# EAGLE design b (EAGLE 9.6.2)
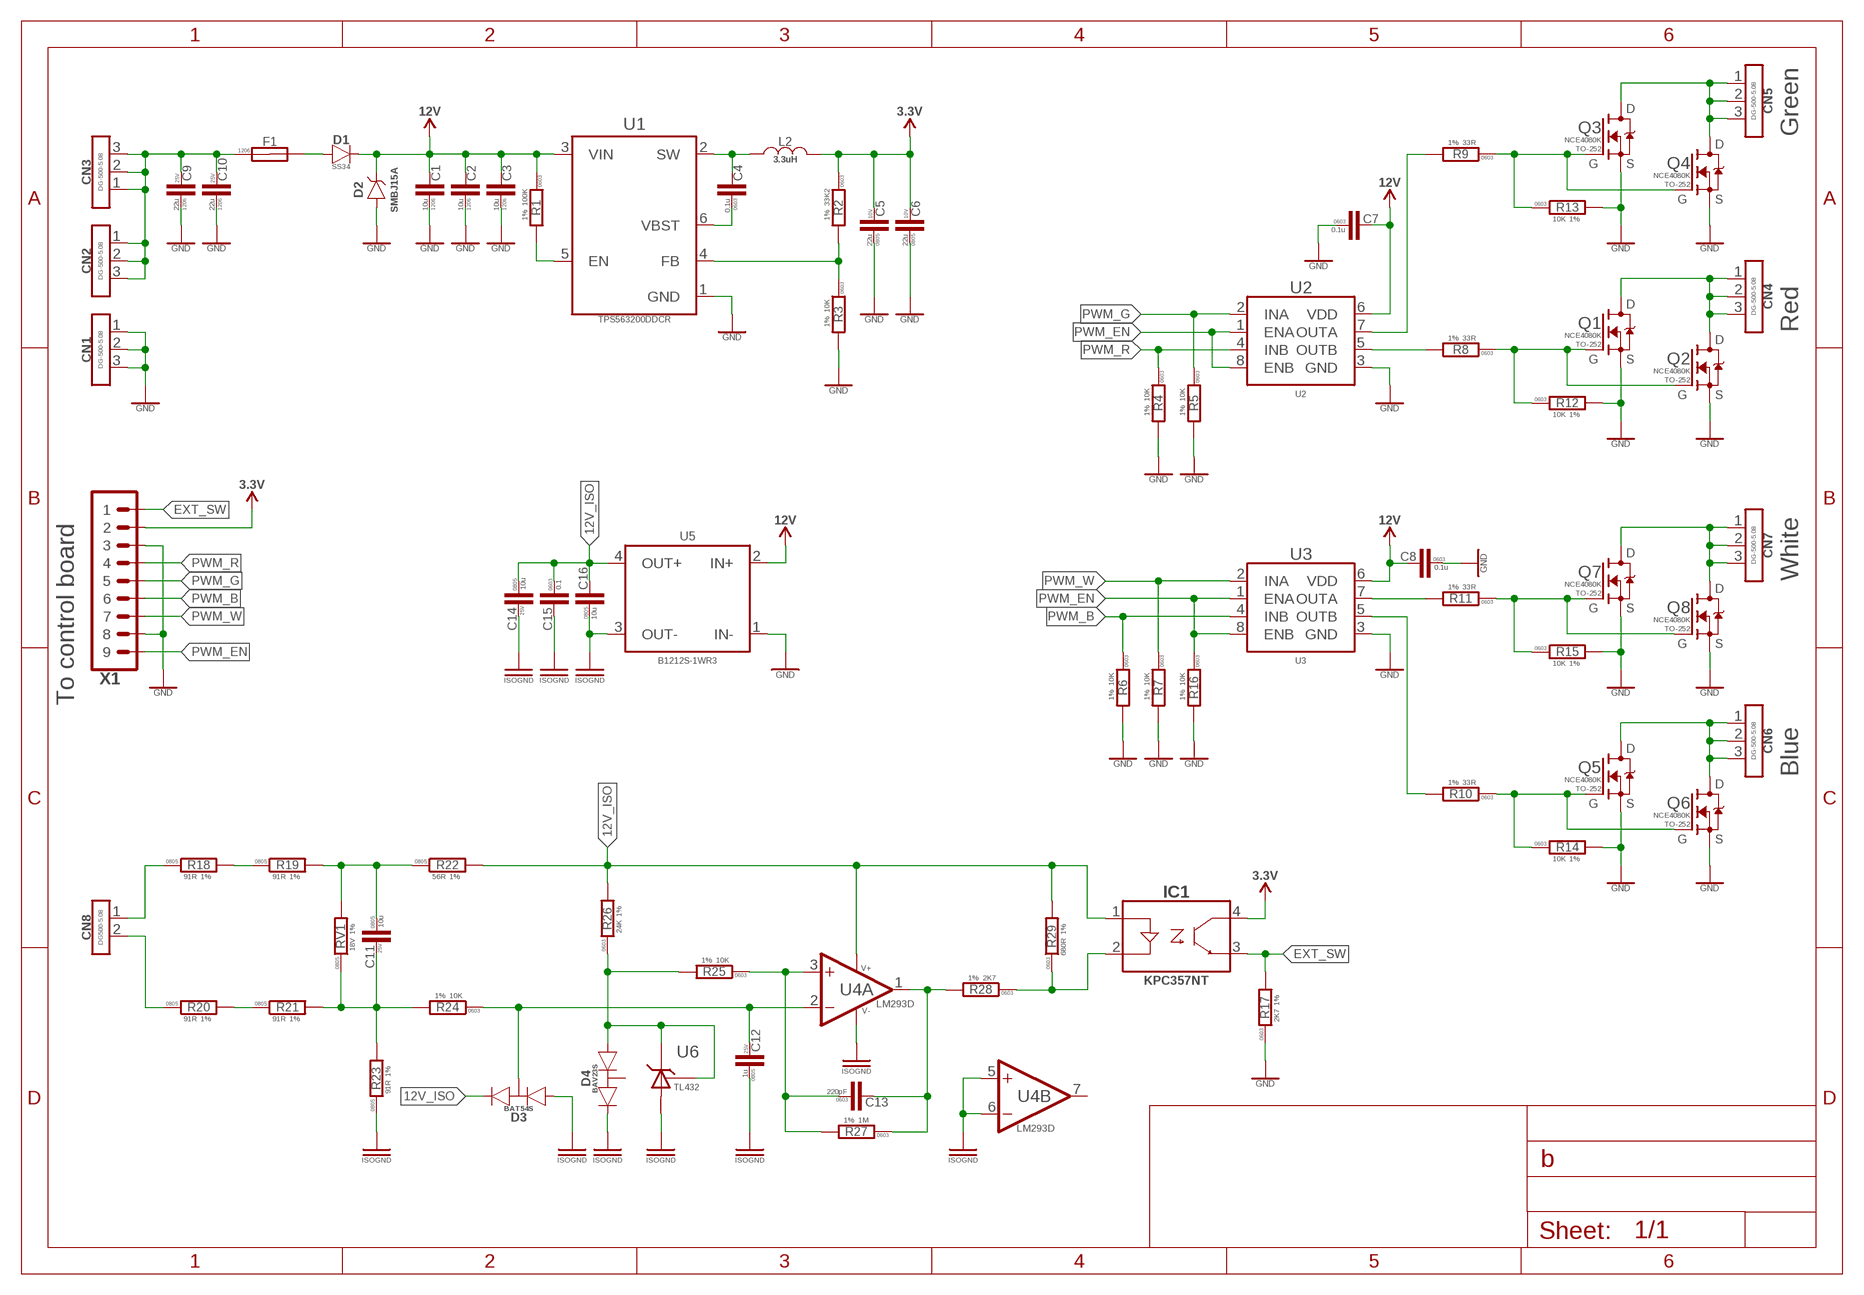
[diagram p0: schematic, sheet 1]

## Parts
C1  10u  C-1206  [C1206]
C2  10u  C-1206  [C1206]
C3  10u  C-1206  [C1206]
C4  0.1u  C-0603  [C0603]
C5  22u  C-0805  [C0805]
C6  22u  C-0805  [C0805]
C7  0.1u  C-0603  [C0603]
C8  0.1u  C-0603  [C0603]
C9  22u  C-1206  [C1206]
C10  22u  C-1206  [C1206]
C11  10u  C-0805  [C0805]
C12  1u  C-0805  [C0805]
C13  220pF  C-0603  [C0603]
C14  10u  C-0805  [C0805]
C15  0.1  C-0603  [C0603]
C16  10u  C-0805  [C0805]
CN1  CON-3P-DG500-5.08  [DG500-5.08-03P]
CN2  CON-3P-DG500-5.08  [DG500-5.08-03P]
CN3  CON-3P-DG500-5.08  [DG500-5.08-03P]
CN4  CON-3P-DG500-5.08  [DG500-5.08-03P]
CN5  CON-3P-DG500-5.08  [DG500-5.08-03P]
CN6  CON-3P-DG500-5.08  [DG500-5.08-03P]
CN7  CON-3P-DG500-5.08  [DG500-5.08-03P]
CN8  DG508V-2P  CON-2P-DG500-5.08  [DG500-5.08-02P]
D1  SS24  SS34  [DO-214AC(SMA)]
D2  SMBJ15A-SMB  [DO-214AA(SMB)]
D3  BAT54S  BAT54S-SOT23  [SOT23]
D4  BAV23S-SOT23  [SOT23]
F1  eFUSE-1206-500mA  FUSE-1206  [F1206]
IC1  KPC357NT-SOP-4  [-SOP-4]
L2  3.3uH  3.3µH-SWPA6020  [SWPA6020]
Q1  100N04  NCE4080K  [D-PAK]
Q2  100N04  NCE4080K  [D-PAK]
Q3  100N04  NCE4080K  [D-PAK]
Q4  100N04  NCE4080K  [D-PAK]
Q5  100N04  NCE4080K  [D-PAK]
Q6  100N04  NCE4080K  [D-PAK]
Q7  100N04  NCE4080K  [D-PAK]
Q8  100N04  NCE4080K  [D-PAK]
R1  100K  R-1%-0603  [R0603]
R2  33K2  R-1%-0603  [R0603]
R3  10K  R-1%-0603  [R0603]
R4  10K  R-1%-0603  [R0603]
R5  10K  R-1%-0603  [R0603]
R6  10K  R-1%-0603  [R0603]
R7  10K  R-1%-0603  [R0603]
R8  33R  R-1%-0603  [R0603]
R9  33R  R-1%-0603  [R0603]
R10  33R  R-1%-0603  [R0603]
R11  33R  R-1%-0603  [R0603]
R12  10K  R-1%-0603  [R0603]
R13  10K  R-1%-0603  [R0603]
R14  10K  R-1%-0603  [R0603]
R15  10K  R-1%-0603  [R0603]
R16  10K  R-1%-0603  [R0603]
R17  2K7  R-1%-0603  [R0603]
R18  91R  R-1%-0805  [R0805]
R19  91R  R-1%-0805  [R0805]
R20  91R  R-1%-0805  [R0805]
R21  91R  R-1%-0805  [R0805]
R22  56R  R-1%-0805  [R0805]
R23  91R  R-1%-0805  [R0805]
R24  10K  R-1%-0603  [R0603]
R25  10K  R-1%-0603  [R0603]
R26  24K  R-1%-0603  [R0603]
R27  1M  R-1%-0603  [R0603]
R28  2K7  R-1%-0603  [R0603]
R29  680R  R-1%-0603  [R0603]
RV1  18V  R-1%-0805  [R0805]
U1  TPS563200  [SOT23-6]
U2  PN7762S  [SOIC8]
U3  PN7762S  [SOIC8]
U4  LM293D  LM293D-SO8  [SOIC8]
U5  B1212S-1WR3  [SIP-4]
U6  TL432  [SOT23B-3]
X1  PINHEAD_1X09-2.54-TH-MALE  [1X09-PTH-2.54]

## Nets
12V_ISO: C14.1 C15.1 C16.2 D3.2(C) IC1.1(A) R22.2 R26.2 R29.2 U4.8(P:V+) U5.4(OUT+)
B_OUT: CN6.1 CN6.2 CN6.3 Q5.D Q6.D
EXT_SW: IC1.3(EMITTER) R17.2 X1.1
G_OUT: CN5.1 CN5.2 CN5.3 Q3.D Q4.D
GND: C1.P$1 C2.P$1 C3.P$1 C5.1 C6.1 C7.1 C8.1 C9.P$1 C10.P$1 CN1.1 CN1.2 CN1.3 D2.A Q1.S Q2.S Q3.S Q4.S Q5.S Q6.S Q7.S Q8.S R3.2 R4.2 R5.2 R6.2 R7.2 R12.2 R13.2 R14.2 R15.2 R16.2 R17.1 U1.1(GND) U2.3(GND) U3.3(GND) U5.1(IN-) X1.3 X1.8
ISOGND: C12.1 C14.2 C15.2 C16.1 D3.1(A) D4.2(C) R23.1 U4.4(P:V-) U4.5(B:IN+) U4.6(B:IN-) U5.3(OUT-) U6.3(A)
N$1: Q1.G Q2.G R8.1 R12.1
N$2: R1.2 U1.5(EN)
N$3: Q3.G Q4.G R9.1 R13.1
N$4: D1.A F1.P$2
N$8: R11.2 U3.7(OUTA)
N$9: R10.2 U3.5(OUTB)
N$10: R8.2 U2.5(OUTB)
N$11: Q5.G Q6.G R10.1 R14.1
N$13: Q7.G Q8.G R11.1 R15.1
N$15: C4.1 U1.6(VBST)
N$18: R9.2 U2.7(OUTA)
N$19: C4.2 L2.1 U1.2(SW)
N$23: IC1.2(C) R28.1 R29.1
N$27: R2.2 R3.1 U1.4(FB)
N$31: C13.2 R27.1 R28.2 U4.1(A:OUT)
N$40: C12.2 D3.3(COMMON) R24.1 U4.2(A:IN-)
N$57 [24V]: C11.1 R19.2 R22.1 RV1.2
N$66 [24V]: R18.2 R19.1
N$71 [24V]: R20.2 R21.1
N$73: C13.1 R25.1 R27.2 U4.3(A:IN+)
N$74: D4.1(A) R25.2 R26.1 U6.1(R) U6.2(C)
N$76: C11.2 R21.2 R23.2 R24.2 RV1.1
PWM_B: R6.1 U3.4(INB) X1.6
PWM_EN: R16.1 U2.1(ENA) U2.8(ENB) U3.1(ENA) U3.8(ENB) X1.9
PWM_G: R5.1 U2.2(INA) X1.5
PWM_R: R4.1 U2.4(INB) X1.4
PWM_W: R7.1 U3.2(INA) X1.7
R_OUT: CN4.1 CN4.2 CN4.3 Q1.D Q2.D
SW_IN+ [24V]: CN8.1 R18.1
SW_IN- [24V]: CN8.2 R20.1
V+: C9.P$2 C10.P$2 CN2.1 CN2.2 CN2.3 CN3.1 CN3.2 CN3.3 F1.P$1
VDD_3V3: C5.2 C6.2 IC1.4(COLLECTOR) L2.2 R2.1 X1.2 ; supply symbol labelled 3.3V
VDD_12V: C1.P$2 C2.P$2 C3.P$2 C7.2 C8.2 D1.C D2.C R1.1 U1.3(VIN) U2.6(VDD) U3.6(VDD) U5.2(IN+) ; supply symbol labelled 12V
Y_OUT: CN7.1 CN7.2 CN7.3 Q7.D Q8.D
Unconnected: D4.3(COMMON) U4.7(B:OUT)

## Notes on the sheet
- Green
- Red
- White
- To control board
- Blue

## Library data of the parts
C1-C3 = rc:C; PACKAGE: 1206
C4 C7 C8 C13 C15 = rc:C; PACKAGE: 0603
C5 C6 = rc:C; PACKAGE: 0805; VOLTAGE: 10V
C9 C10 = rc:C; PACKAGE: 1206; VOLTAGE: 25V
C11 C12 C14 = rc:C; PACKAGE: 0805; VOLTAGE: 25V
C16 = rc:C; PACKAGE: 0805
CN1-CN7 = degson:CON-3P; MANF: Degson Electronics; MANF#: DG-500-5.08-03P-14; TYPE: DG-500-5.08
CN8 = degson:CON-2P; MANF: Degson Electronics; MANF#: DG-500-5.08-02P-14; TYPE: DG500-5.08
D1 = Diodes:SS34: 40V 3A 550mV @ 3A SMA(DO-214AC) Schottky Barrier Diodes; LCSC#: C8678; MANF: MDD（Microdiode Electronics）; MANF#: SS34
D2 = TVS_diodes:SMBJ15A: 15V Unidirectional SMB(DO-214AA) TVS ROHS; MANF: Littelfuse; MANF#: SMBJ15A
D3 = Diodes:BAT54S: Planar Schottky barrier diodes; MANF: NEXPERIA; MANF#: BAT54S
D4 = Diodes:BAV23S: Small Signal Diode; MANF: NEXPERIA; MANF#: BAV23S
F1 = rc:FUSE; CURRENT: 500 mA; PACKAGE: 1206
IC1 = misc:KPC357NT: 4PIN MINI-FLAT PHOTOTRANSISTOR PHOTOCOUPLER; MANF: COSMO; MANF#: KPC357NT
L2 = power_inductors:3.3µH; MANF: Sunlord; MANF#: SWPA6020S3R3NT
Q1-Q8 = mosfet:NCE4080K: N-Channel 75V 42A power MOSFET, Rdson = 0.026 Ohm; MANF: NCE; MANF#: NCE4080K; PACKAGE: TO-252
R1-R17 R24-R29 = rc:R; PACKAGE: 0603; TOLERANCE: 1%
R18-R23 RV1 = rc:R; PACKAGE: 0805; TOLERANCE: 1%
U1 = dc-dc:TPS563200: TPS56x200 4.5-V To 17-V Input, 2-A, 3-A Synchronous Step-Down Voltage Regulator In6 Pin SOT-23 datasheet <https://static.chipdip.ru/lib/786/DOC059786447.pdf>; MANF: Texas Instruments; MANF#: TPS563200DDCR
U2 U3 = misc:PN7762S: Dual channel 5A mosfet driver; MANF: Chipown; MANF#: PN7762S
U4 = misc:LM293D: Low-power, dual-voltage comparators; MANF: STMicroelectronics; MANF#: LM293D
U5 = dc-dc:B1212S-1WR3: 1W, Fixed input voltage, isolated & unregulated single output dc-dc converter; MANF: Mornsun Power; MANF#: B1212S-1WR3
U6 = misc:TL432: Adjustable precision shunt regulator (reverse pinout); MANF: Texas Instruments; MANF#: TL432
X1 = pinhead:PINHEAD_1X09

## Net classes
0 default: width 0.254 mm, clearance 0.254 mm
1 24V: clearance 0.305 mm
2 12v: width 0.254 mm, drill 0.508 mm, clearance 0.254 mm
3 rs485: width 0.254 mm, drill 0.508 mm, clearance 0.254 mm
12 Vbat: width 0.229 mm, clearance 0.305 mm

## Board
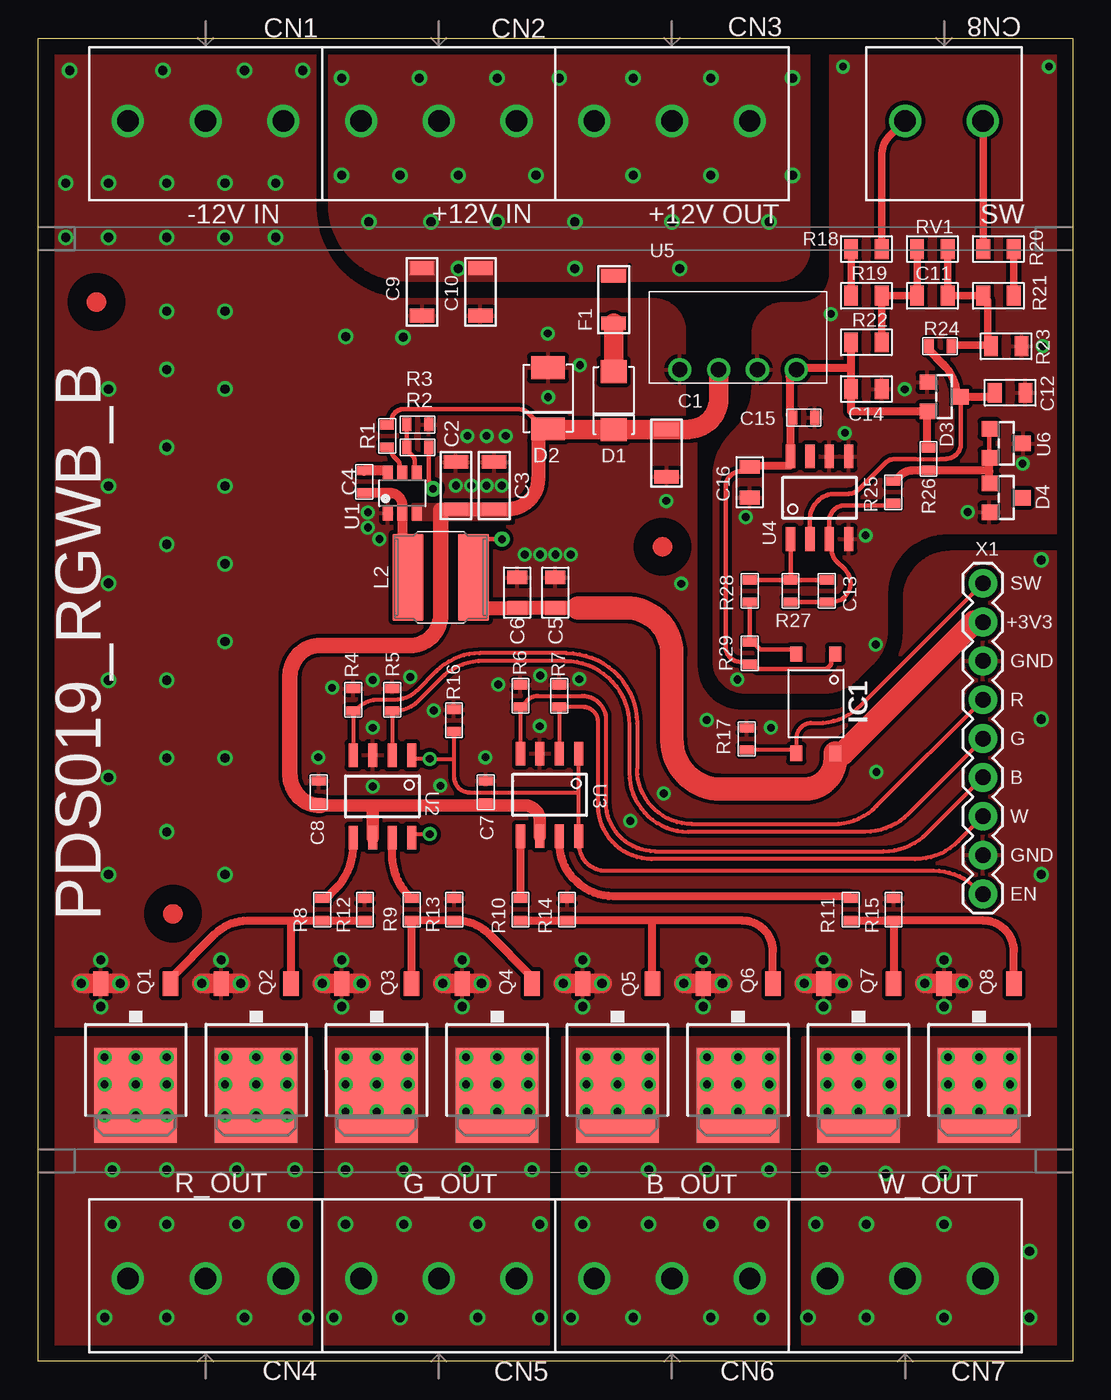
[diagram p1: board, top side]
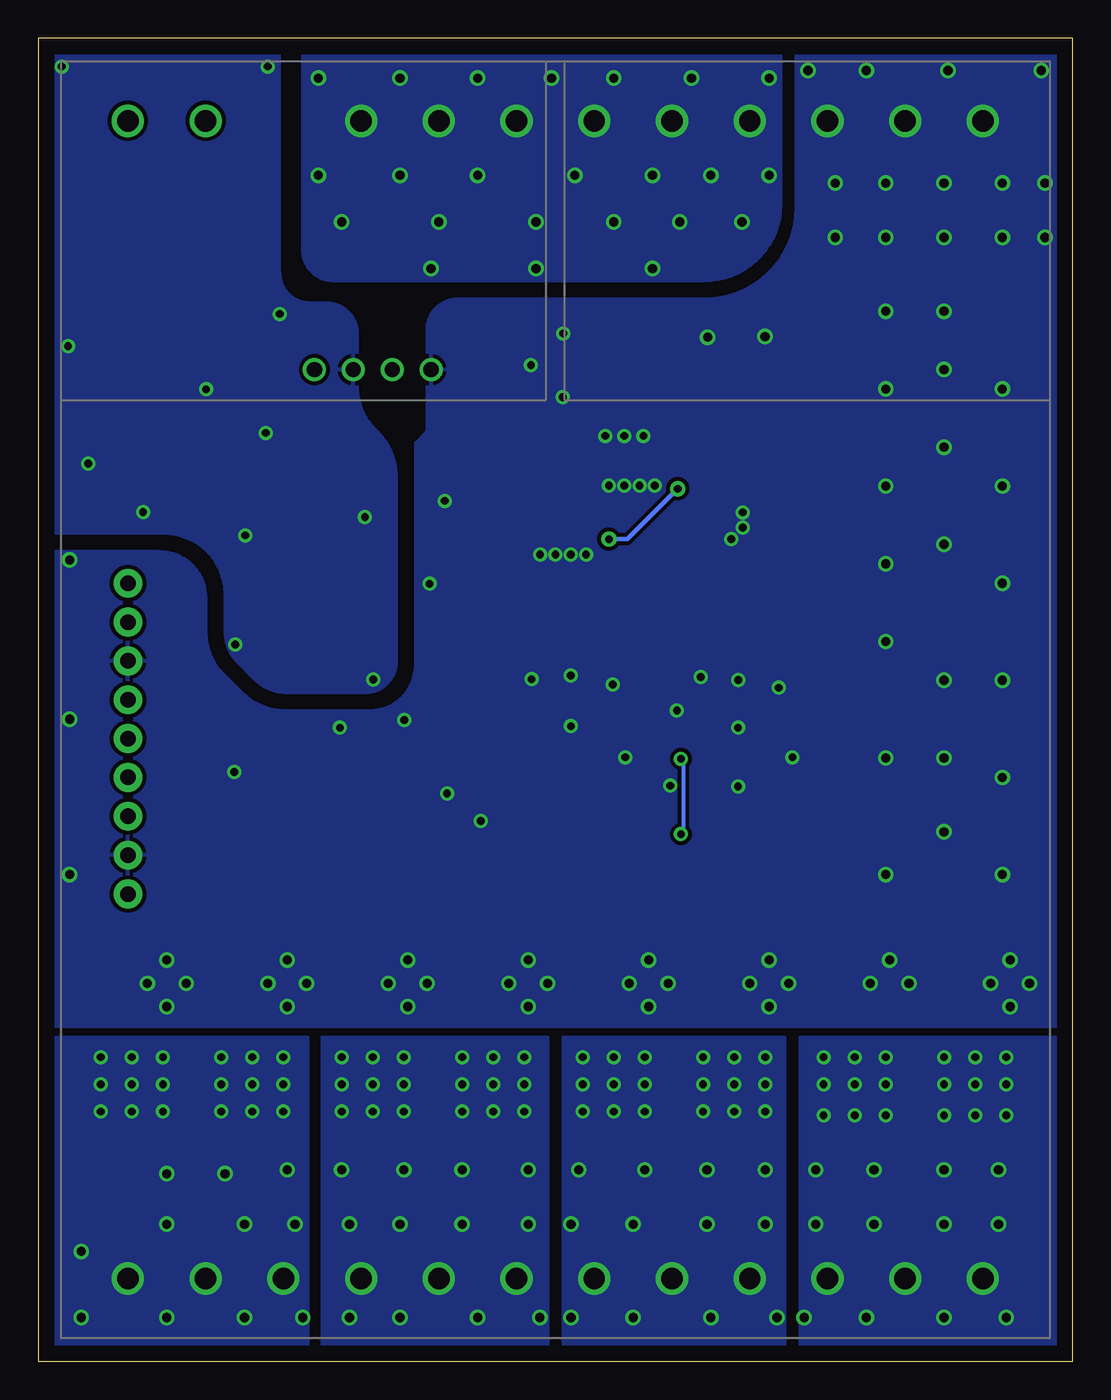
[diagram p2: board, bottom side, seen from below]

Size 67.6 x 86.5 mm. Coordinates in mm from the lower left corner, seen from the top.
Outline: 0,86.5 67.6,86.5 67.6,0 0,0 0,86.5
Copper layers (1*16): Top 0.035mm / dielectric 1.5mm / Bottom 0.035mm
Design rules "pds019_rgbw *": minimum track width 8mil, minimum drill 0.5mm, track to track 8mil, track to pad 8mil, pad to pad 8mil, via to via 8mil, smd to smd 0mil, copper to edge 40mil, drill to drill 8mil, minimum pad ring 10mil, minimum via ring 8mil, stop-mask expansion 4mil, vias tented up to drill 0.7mm, thermal gap 10mil
tRestrict: 2 lines

### Footprints (pad centres in the part's own frame; a part is rotated, then mirrored left to right if it is on the bottom)
C1206 = smd 0.9 x 1.6: P$1 -1.55,0; P$2 1.55,0
C0603 = smd 0.6 x 0.9: 1 -0.725,0; 2 0.725,0
C0805 = smd 0.9 x 1.3: 1 -1,0; 2 1,0
DG500-5.08-03P = drill 1.4: 1 -5.08,0; 2 0,0; 3 5.08,0
DG500-5.08-02P = drill 1.4: 1 -2.54,0; 2 2.54,0
DO-214AC(SMA) = smd 1.5 x 1.7: A -1.9,0; C 1.9,0
DO-214AA(SMB) = smd 1.5 x 2.2: A -2,0; C 2,0
SOT23 = smd 1 x 1: 1 1.1,-0.95; 2 1.1,0.95; 3 -1.1,0
F1206 = smd 0.9 x 1.6: P$1 -1.55,0; P$2 1.55,0
-SOP-4 = smd 1 x 0.8: 1 -3.25,1.27; 2 -3.25,-1.27; 3 3.25,-1.27; 4 3.25,1.27
SWPA6020 = smd 2.032 x 5.69: 1 -2.134,0; 2 2.134,0
D-PAK = smd 5.4 x 6.2: D 0,2.5 | smd 1 x 1.6: G -2.28,-4.8; S 2.28,-4.8
R0603 = smd 0.6 x 0.9: 1 -0.725,0; 2 0.725,0
R0805 = smd 0.9 x 1.3: 1 -1,0; 2 1,0
SOT23-6 = smd 1 x 0.65: 1 1.3,-0.95; 2 1.3,0; 3 1.3,0.95; 4 -1.3,0.95; 5 -1.3,0; 6 -1.3,-0.95
SOIC8 = smd 0.6 x 1.55: 1 -1.905,-2.7; 2 -0.635,-2.7; 3 0.635,-2.7; 4 1.905,-2.7; 5 1.905,2.7; 6 0.635,2.7; 7 -0.635,2.7; 8 -1.905,2.7
SIP-4 = drill 1 pad 1.5: 1 -3.81,-2.1; 2 -1.27,-2.1; 3 1.27,-2.1; 4 3.81,-2.1
SOT23B-3 = smd 1 x 1: 1 -0.95,-1.1; 2 0.95,-1.1; 3 0,1.1
1X09-PTH-2.54 = drill 1.016 pad 1.88: 1 -10.16,0; 2 -7.62,0; 3 -5.08,0; 4 -2.54,0; 5 0,0; 6 2.54,0; 7 5.08,0; 8 7.62,0; 9 10.16,0

### Placement (x,y rotation side)
C1  41.06,59.38 90 top
C2  27.3,57.25 270 top
C3  29.8,57.25 270 top
C4  21.3,57.5 270 top
C5  33.8,50.25 270 top
C6  31.3,50.25 270 top
C7  29.25,37.2 270 top
C8  18.33,37.2 270 top
C9  25.08,69.92 90 top
C10  28.89,69.92 90 top
C11  58.44,69.67 0 top
C12  63.52,63.32 180 top
C13  51.53,50.36 90 top
C14  54.12,63.57 0 top
C15  50.03,61.69 0 top
C16  46.5,57.47 90 top
CN1  10.94,81.1 0 top
CN2  26.18,81.1 0 top
CN3  41.42,81.1 0 top
CN4  10.94,5.4 180 top
CN5  26.18,5.4 180 top
CN6  41.42,5.4 180 top
CN7  56.66,5.4 180 top
CN8  59.2,81.1 0 top
D1  37.61,62.81 270 top
D2  33.32,62.96 270 top
D3  59.2,63.06 180 top
D4  63.26,56.46 180 top
F1  37.61,69.41 270 top
IC1  50.82,43 270 top
L2  26.3,51.25 0 top
PCB1  [D4MG_PCB]  33.8,43.25 0 top
Q1  6.37,19.88 180 top
Q2  14.24,19.88 180 top
Q3  22.12,19.88 180 top
Q4  29.99,19.88 180 top
Q5  37.86,19.88 180 top
Q6  45.74,19.88 180 top
Q7  61.49,19.88 180 top
Q8  53.61,19.88 180 top
R1  22.8,60.5 270 top
R2  24.8,59.75 180 top
R3  24.8,61.25 0 top
R4  20.59,43.25 90 top
R5  23.13,43.25 90 top
R6  31.51,43.5 90 top
R7  34.05,43.5 90 top
R8  18.56,29.53 90 top
R9  24.4,29.53 90 top
R10  31.51,29.53 90 top
R11  53.1,29.53 90 top
R12  21.35,29.53 90 top
R13  27.2,29.53 90 top
R14  34.56,29.53 90 top
R15  55.9,29.53 90 top
R16  27.17,41.9 90 top
R17  46.3,40.68 270 top
R18  54.12,72.71 180 top
R19  54.12,69.67 0 top
R20  62.76,72.71 0 top
R21  62.76,69.67 180 top
R22  54.12,66.62 180 top
R23  63.26,66.36 180 top
R24  58.95,66.36 0 top
R25  55.87,56.81 90 top
R26  58.18,59 90 top
R27  49.17,50.36 270 top
R28  46.5,50.36 90 top
R29  46.5,46.3 270 top
REP1  [REF_POINT_D1.27_D3.81]  8.8,29.25 0 top
REP2  [REF_POINT_D1.27_D3.81]  3.8,69.25 0 top
REP3  [REF_POINT_D1.27_D3.81]  40.8,53.25 0 top
RV1  58.44,72.71 180 top
U1  23.8,56.75 270 top
U2  22.5,36.93 180 top
U3  33.42,37.03 180 top
U4  51.07,56.46 0 top
U5  45.74,66.94 0 top
U6  63.26,60.01 270 top
X1  61.74,40.71 270 top

### Tracks (layer width: path | path; a pad name or v marks a point on that pad's centre or on a via)
12V_ISO
  Top 0.305: C16.2 46.2,58.17 45.92,58.17 arc90 44.92,57.17 44.92,46.72 arc90 45.92,45.72 46.35,45.72 R29.2 46.68,45.57 47,45.25 51.34,45.25 arc90 51.84,45.75 51.84,46.25 IC1.1
  Top 0.508: 53.12,64.95 C14.1 53.1,63.55 53.1,62.12 53.11,62.11 D3.2 58.1,59.81 R26.2 | 53.12,64.95 R22.2 | 53.12,64.95 49.66,64.95 U5.4 49.11,64.4 49.11,61.89 C15.1 49.17,61.55 U4.8 49.17,58.57 46.6,58.57 C16.2
B_OUT  (via drill 0.51, 0.6)
  other vias: 35.83,19.88 39.9,18.1 37.86,19.88 39.9,19.88 43.71,19.88 35.83,18.1 37.86,18.1 43.71,18.1 35.83,16.33 37.86,16.33 39.9,16.33 43.71,16.33 45.74,19.88 47.77,19.88 45.74,18.1 47.77,18.1 45.74,16.33 47.77,16.33 35.58,8.96 39.9,8.96 43.96,8.96 47.26,8.96 34.82,2.86 38.88,2.86 43.96,2.86 47.26,2.86 35.58,12.52 39.9,12.52 43.71,12.52 47.77,12.52
  pour Top (no thermals): 34.31,21.15 49.04,21.15 49.04,1.09 34.31,1.09
  pour Bottom (no thermals): 34.31,21.15 49.04,21.15 49.04,1.09 34.31,1.09
EXT_SW
  Top 0.254: X1.1 61.74,50.85 53.78,42.9 arc-45 50.95,41.73 50.55,41.73 arc90 49.55,40.73 IC1.3 49.33,39.96 R17.2
G_OUT  (via drill 0.51, 0.6)
  other vias: 20.08,19.88 20.08,18.1 20.08,16.33 22.12,19.88 24.15,19.88 27.96,19.88 29.99,19.88 22.12,18.1 22.12,16.33 24.15,16.33 24.15,18.1 27.96,18.1 27.96,16.33 29.99,18.1 29.99,16.33 32.02,19.88 32.02,18.1 32.02,16.33 19.32,2.86 23.64,2.86 28.72,2.86 32.78,2.86 20.08,8.96 23.89,8.96 28.72,8.96 32.78,8.96 20.08,12.52 23.89,12.52 27.96,12.52 32.28,12.52
  pour Bottom (isolate 0.508, no thermals): 18.81,21.15 33.29,21.15 33.29,1.09 18.81,1.09
  pour Top (no thermals): 18.81,21.15 33.29,21.15 33.29,1.09 18.81,1.09
GND  (via drill 0.51, 0.6)
  Top 1.27: v2.81,24.71 v5.35,24.71 | v10.69,24.71 v13.23,24.71 | v18.56,24.71 v21.1,24.71 | v26.43,24.71 v28.97,24.71 | v34.31,24.71 v36.85,24.71 | v42.18,24.71 v44.72,24.71 | v50.06,24.71 v52.6,24.71 | v57.93,24.71 v60.47,24.71
  other vias: 4.08,26.23 4.08,23.18 19.83,23.18 19.83,26.23 43.45,26.23 43.45,23.18 35.58,26.23 35.58,23.18 59.2,26.23 51.33,26.23 30.55,60.5 17.29,84.4 8.15,84.4 65.55,52.39 65.55,41.98 59.2,23.18 51.33,23.18 13.48,84.4 2.05,84.4 1.8,77.03 41.04,56.25 29.23,39.49 32.78,41.52 26.29,37.63 21.86,37.59 21.86,41.42 18.31,39.49 4.59,63.57 4.59,57.22 8.4,68.65 12.21,68.65 12.21,63.57 12.21,52.14 12.21,57.22 8.4,64.84 8.4,59.76 8.4,53.41 8.4,77.03 12.21,77.03 15.51,77.03 1.8,73.48 8.4,73.48 12.21,73.48 15.51,73.48 4.59,50.87 4.59,44.52 8.4,44.52 4.59,38.17 4.59,31.82 8.4,39.44 8.4,34.61 12.21,47.06 12.21,31.82 12.21,39.44 33.29,67.2 33.32,63.04 35.4,65.12 27.7,23.18 65.55,31.82 11.96,26.23 4.59,77.03 4.59,73.48 27.7,26.23 42.03,50.83 21.55,55.5 22.3,53.75 29.3,57.25 28.3,57.25 30.3,57.25 33.8,52.75 32.8,52.75 31.8,52.75 34.8,52.75 27.3,57.25 29.3,60.5 21.55,54.5 28.05,60.5 19.21,44.04 21.86,44.54 30.06,44.24 32.81,44.84 35.36,44.59 24.31,44.74 25.86,42.54 20.1,67 23.85,66.95 43.68,41.92 47.88,41.42 54.78,38.52 40.88,37.12 38.68,35.32
  pour Top (rank 6): 18.05,85.41 18.05,75.41 arc90 24.05,69.41 40.18,69.41 arc-90 42.18,67.41 42.18,60.78 42.94,60.01 42.94,45.49 arc90 45.94,42.49 51.45,42.49 arc45 54.28,43.66 55.49,44.87 arc45 56.66,47.7 56.66,49.9 arc-90 59.66,52.9 66.82,52.9 66.82,21.91 1.03,21.91 1.03,85.41
  pour Bottom (rank 6): 1.03,85.41 18.05,85.41 18.05,75.41 arc90 24.05,69.41 40.18,69.41 arc-90 42.18,67.41 42.18,60.78 42.94,60.01 42.94,45.49 arc90 45.94,42.49 51.45,42.49 arc45 54.28,43.66 55.49,44.87 arc45 56.66,47.7 56.66,49.9 arc-90 59.66,52.9 66.82,52.9 66.82,21.91 1.03,21.91
  pour Bottom (no thermals): 1.03,85.41 18.05,85.41 18.05,76.27 1.03,76.27
  pour Top (no thermals): 1.03,85.41 18.05,85.41 18.05,76.27 1.03,76.27
ISOGND  (via drill 0.51)
  other vias: 60.75,55.52 51.81,68.47 46.25,55.19 54.07,53.99 52.72,60.7 56.63,63.54 52.6,84.65 66.06,84.65 64.33,58.69 65.65,66.36 45.7,44.57 54.73,46.86
  pour Top (rank 2): 51.83,85.41 66.82,85.41 66.82,54.17 59.39,54.17 arc90 55.39,50.17 55.39,47.79 arc-45 54.51,45.67 53.47,44.64 arc-45 51.35,43.76 46.21,43.76 arc-90 44.21,45.76 44.21,57.85 arc-45 45.39,60.68 45.58,60.87 arc45 46.75,63.7 46.75,67.16 arc-90 48.75,69.16 49.83,69.16 arc90 51.83,71.16
  pour Bottom: 51.83,85.41 66.82,85.41 66.82,54.17 59.39,54.17 arc90 55.39,50.17 55.39,47.79 arc-45 54.51,45.67 53.47,44.64 arc-45 51.35,43.76 46.21,43.76 arc-90 44.21,45.76 44.21,57.85 arc-45 45.39,60.68 45.58,60.87 arc45 46.75,63.7 46.75,67.16 arc-90 48.75,69.16 49.83,69.16 arc90 51.83,71.16
N$1
  Top 0.508: R12.1 R8.1 16.5,28.81 | 16.5,28.81 13.67,28.81 arc45 11.55,27.93 8.65,25.03 Q1.G | Q2.G 16.52,28.79 16.5,28.81
N$2
  Top 0.3: R1.2 23.1,59.77 23.1,59.51 arc45 23.25,59.15 23.48,58.92 arc-45 23.62,58.57 23.62,58.05 U1.5
N$3
  Top 0.508: Q4.G 32.27,25.12 29.46,27.93 arc45 27.34,28.81 R13.1 R9.1 Q3.G
N$4
  Top 1.27: F1.P$2 D1.A
N$8
  Top 0.508: R11.2 52.96,30.4 37.6,30.4 arc-90 34.05,33.95 U3.7
N$9
  Top 0.508: U3.5 R10.2
N$10
  Top 0.508: U2.5 20.59,33.7 arc-45 19.42,30.87 18.81,30.26 R8.2
N$11
  Top 0.508: Q6.G 48.02,26.81 arc90 46.02,28.81 40.2,28.81 | R10.1 R14.1 40.2,28.81 | 40.2,28.81 40.14,28.75 Q5.G
N$13
  Top 0.508: Q7.G 63.77,26.81 arc90 61.77,28.81 R15.1 | Q8.G R15.1 | R11.1 R15.1
N$15
  Top 0.65: U1.6 22.67,58.23 C4.1
N$18
  Top 0.508: R9.2 24.36,30.26 24.3,30.31 arc-45 23.13,33.14 U2.7
N$19
  Top 0.65: L2.1 23.8,51.62 U1.2 23.8,55.95 arc90 22.97,56.77 C4.2
N$23
  Top 0.305: IC1.2 49.25,46.55 47.18,46.55 46.7,47.02 R29.1 R28.1
N$27
  Top 0.3: R3.1 R2.2 24.07,59.6 24.45,59.22 arc-45 24.6,58.87 24.6,58.2 U1.4
N$31
  Top 0.305: C13.2 R27.1 | R28.2 R27.1 | U4.1 R27.1
N$40
  Top 0.254: 57.32,59 58.97,59
  Top 0.305: 57.32,59 56.04,59 arc45 55.33,58.7 53.63,57.01 arc-45 52.92,56.71 52.09,56.71 arc90 50.44,55.06 U4.2 | 58.97,59 59.3,59 arc90 60.3,60 D3.3
  Top 0.5: 58.22,66.11 R24.1
  Top 0.508: 60.04,63.06 D3.3 62.26,63.06 C12.2 | 60.04,63.06 | 60.04,63.06 arc45 59.16,65.17 58.22,66.11
N$57
  Top 0.5: RV1.2 C11.1 R19.2 R22.1
N$66
  Top 0.5: R19.1 R18.2
N$71
  Top 0.5: R21.1 R20.2
N$73
  Top 0.305: R27.2 C13.1 51.85,49.64 arc135 52.73,51.75 52.15,52.33 arc-45 51.86,53.04 51.86,53.61 U4.3 51.71,54.95 arc-90 52.71,55.95 55.73,55.95 R25.1
N$74
  Top 0.305: U6.1 62.16,59.3 U6.2
  Top 0.508: R25.2 55.97,57.54 56.36,57.93 arc-45 57.07,58.22 58.13,58.22 R26.1 58.23,58.22 62.14,58.22 62.16,58.2 | D4.1 62.16,58.2 | 62.16,58.2 62.16,59.3
N$76
  Top 0.5: RV1.1 C11.2 R21.2 62.06,69.36 62.06,66.45 | R23.2 62.26,66.45 62.06,66.45 | R24.2 59.76,66.45 62.06,66.45
PWM_B
  Top 0.254: X1.6 58.09,34.52 arc-45 55.26,33.34 40.3,33.34 arc-90 37.1,36.54 37.1,41.95 arc90 35.55,43.5 32.65,43.5 arc45 31.95,43.21 R6.1 U3.4
PWM_EN  (via drill 0.51)
  Top 0.254: X1.9 61.7,30.55 61.35,30.9 arc45 58.52,32.07 37.07,32.07 arc-90 35.32,33.82 U3.8 35.32,37.2 | 35.32,37.2 28.17,37.2 arc-90 27.17,38.2 27.17,39.4 | 35.32,37.2 U3.1 | U2.8 24.64,34.46 v25.6,34.46 | U2.1 24.64,39.39 v25.6,39.39 27.16,39.39 27.17,39.4 | R16.1 27.17,39.4
  Bottom 0.254: v25.6,39.39 25.45,39.24 25.45,34.61 v25.6,34.46
PWM_G
  Top 0.254: X1.5 61.74,40.66 56.86,35.79 arc-45 54.03,34.61 42.48,34.61 arc-90 38.63,38.46 38.63,41.59 arc90 34.43,45.79 29.11,45.79 arc45 26.28,44.62 24.77,43.11 arc-45 23.36,42.52 R5.1 U2.2
PWM_R
  Top 0.254: X1.4 54.78,36.29 arc-45 51.95,35.12 42.73,35.12 arc-90 39.13,38.72 39.13,41.7 arc90 34.53,46.3 28.85,46.3 arc45 26.02,45.13 24.73,43.84 arc-45 23.32,43.25 22.24,43.25 arc45 20.83,42.66 20.69,42.52 R4.1 U2.4
PWM_W
  Top 0.254: X1.7 61.74,35.61 60.14,34.01 arc-45 57.31,32.84 40.09,32.84 arc-90 36.59,36.34 36.59,41.78 arc90 35.59,42.78 R7.1 U3.2
R_OUT  (via drill 0.51, 0.6)
  other vias: 6.37,19.88 8.4,19.88 12.21,19.88 14.24,19.88 6.37,18.1 8.4,18.1 12.21,18.1 14.24,18.1 4.34,19.88 4.34,18.1 16.27,18.1 16.27,19.88 4.84,8.96 8.4,8.96 12.97,8.96 16.78,12.52 4.34,2.86 8.4,2.86 13.48,2.86 17.54,2.86 6.37,16.07 14.24,16.07 16.27,16.07 4.34,16.07 4.84,12.52 8.4,12.52 12.97,12.52 16.78,8.96 8.4,16.07 12.21,16.07
  pour Top (no thermals): 1.03,21.15 17.8,21.15 17.8,0.83 1.03,0.83
  pour Bottom (isolate 0.508, no thermals): 1.03,21.15 17.8,21.15 17.8,0.83 1.03,0.83
SW_IN+
  Top 0.5: R18.1 55.12,78.79 arc-45 55.71,80.21 56.6,81.1 CN8.1
SW_IN-
  Top 0.5: R20.1 61.76,81.08 CN8.2
V+  (via drill 0.6)
  other vias: 19.83,77.54 23.64,77.54 27.45,77.54 19.83,83.89 24.91,83.89 29.99,83.89 32.53,77.54 41.93,71.44 27.45,71.44 35.07,71.44 21.61,74.49 25.67,74.49 29.99,74.49 35.07,74.49 38.88,77.54 43.96,77.54 49.29,77.54 38.88,83.89 43.96,83.89 49.29,83.89 34.05,83.89 41.42,74.49 47.77,74.49
  pour Top (no thermals): 19.07,85.41 50.31,85.41 50.31,72.68 arc-90 48.31,70.68 24.07,70.68 arc-90 19.07,75.68
  pour Bottom (no thermals): 19.07,85.41 50.31,85.41 50.31,72.68 arc-90 48.31,70.68 24.07,70.68 arc-90 19.07,75.68
VDD_3V3  (via drill 0.5 pad 1)
  Top 0.3: R2.1 25.52,57.71 arc45 v25.8,57.05 | v30.3,53.75 28.43,53.75 L2.2
  Top 0.9: L2.2 28.43,49.25 C6.2 C5.2 35.3,49.25
  Top 1.524: X1.2 61.17,48.33 52.59,39.75 IC1.4 52.1,39.41 arc-90 50.1,37.41 44.62,37.41 arc-90 41.42,40.61 41.42,46.25 arc90 38.42,49.25 35.3,49.25
  Bottom 0.3: v25.8,57.05 29.1,53.75 v30.3,53.75
VDD_12V
  Top 0.3: C7.2 29.25,36.39 29.2,36.34 | C8.2 18.47,36.34 | R1.1 23.1,61.23 23.1,61.5 arc-90 23.85,62.25 31.36,62.25 arc-45 32.07,61.96 33.07,60.96 D2.C
  Top 0.813: U3.6 32.78,35.34 arc90 31.78,36.34 29.2,36.34 21.85,36.34 | U2.6 21.86,36.33 21.85,36.34 | 21.85,36.34 18.47,36.34
  Top 0.9: C2.P$2 C3.P$2 30.67,55.7 arc90 32.67,57.7 32.67,60.96 D2.C
  Top 1: 18.47,36.34 18.45,36.34 arc-90 16.45,38.34 16.45,44.8 arc-90 18.45,46.8 24.3,46.8 arc90 26.3,48.8 26.3,55.65
  Top 1.27: U5.2 44.47,62.93 arc-90 42.47,60.93 C1.P$2 37.63,60.93 D1.C 33.37,60.91 D2.C
  pour Top (no thermals): 24.5,56.05 30.8,56.05 30.8,55 24.5,55
Y_OUT  (via drill 0.51, 0.6)
  other vias: 63.52,19.88 61.49,19.88 59.45,19.88 55.64,19.88 53.61,19.88 61.49,18.1 59.45,18.1 55.64,18.1 53.61,18.1 61.49,16.33 59.45,16.33 55.64,16.33 53.61,16.33 63.52,18.1 63.52,16.33 51.58,19.88 51.58,18.1 51.58,16.33 64.79,2.86 59.2,12.26 55.39,12.26 51.33,12.52 59.2,2.86 54.12,2.86 50.31,2.86 50.82,8.96 54.12,8.96 59.2,8.96 64.79,7.18
  pour Bottom (no thermals): 50,1.09 50,21.15 66.57,21.15 66.57,1.09
  pour Top (no thermals): 66.57,1.09 50,1.09 50,21.15 66.57,21.15

### Text on the board
tPlace: -12V IN | +12V IN | +12V OUT | SW | SW | +3V3 | GND | R | G | B | W | GND | EN | PDS019_RGWB_B | R_OUT | G_OUT | B_OUT | W_OUT